# Altium schematic sheet WLAN_BLUETOOTH.SchDoc: WLAN_BLUETOOTH
size A4; Project: STM32MP15-DISCO PI; Date: Not used; ApprovedBy: Not used; CheckedBy: Not used; Author: Not used; CompanyName: STMicroelectronics; DrawnBy: Not used; Engineer: Not used; Organization: Not used; Address1: Not used; Address2: Not used; Address3: Not used; Address4: Not used; DocumentNumber: 14; Revision: Not used; SheetNumber: 14; SheetTotal: 15; CurrentTime: Not used; CurrentDate: Not used; Time: Not used; DocumentFullPathAndName: Not used; DocumentName: Not used; ModifiedDate: Not used; ImagePath: Not used; ProjectName: Not used; Application_BuildNumber: Not used
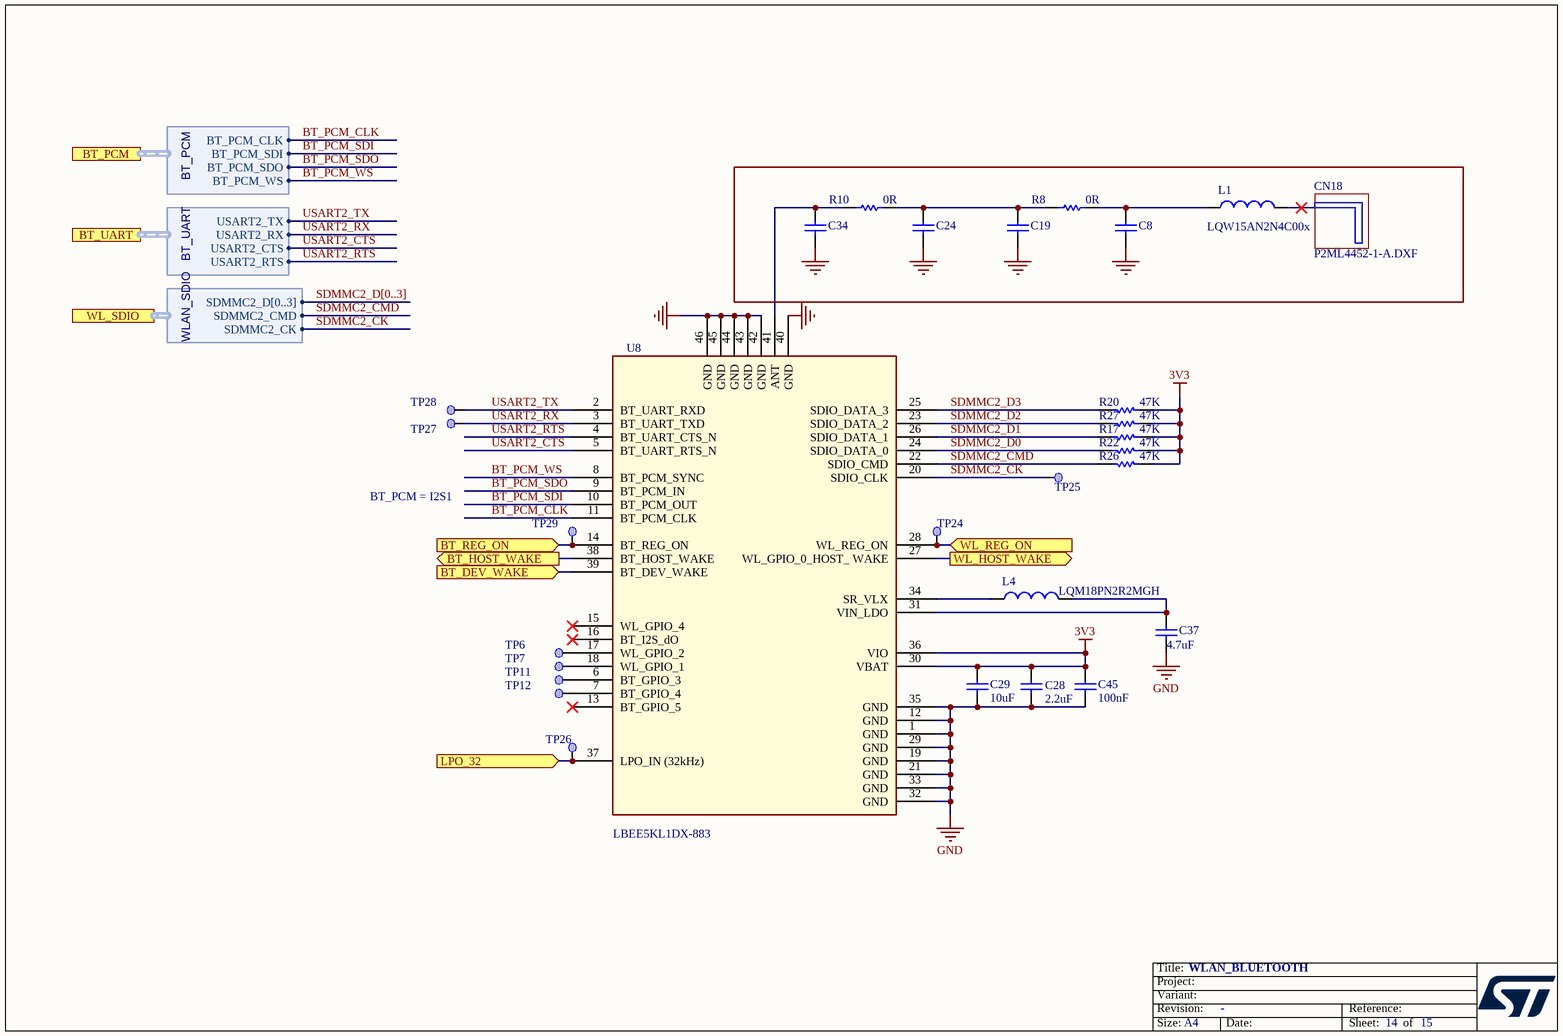
[diagram p0: WLAN_BLUETOOTH.SchDoc]

## Parts
C8  Capacitor  [C0402]  (value not drawn)
C19  Capacitor  [C0402]  (value not drawn)
C24  Capacitor  [C0402]  (value not drawn)
C28  value 2.2uF  [C0603]  (hidden comment: Capacitor)
C29  value 10uF  [C0603]  (hidden comment: Capacitor)
C34  Capacitor  [C0402]  (value not drawn)
C37  value 4.7uF  [C0402]  (hidden comment: Capacitor)
C45  value 100nF  [C0402]
CN18  value P2ML4452-1-A.DXF  [ANT_MURATA_TYPE-1-DX_P2ML4452-1-A_DXF]  (hidden comment: antenna_Wifi_BLE_Murata)  (no BOM)
L1  value LQW15AN2N4C00x  [IND_0402_MURATA_LQW15AN2N4C00X]  (hidden comment: Inductor)
L4  value LQM18PN2R2MGH  [L0603]  (hidden comment: Inductor)
R8  value 0R  [R0402]  (hidden comment: Resistor)
R10  value 0R  [R0402]  (hidden comment: Resistor)
R17  value 47K  [R0402]  (hidden comment: Resistor)
R20  value 47K  [R0402]  (hidden comment: Resistor)
R22  value 47K  [R0402]  (hidden comment: Resistor)
R26  value 47K  [R0402]  (hidden comment: Resistor)
R27  value 47K  [R0402]  (hidden comment: Resistor)
TP6  Test Point  [TP_SMD_1MM]  (value not drawn)  (no BOM)
TP7  Test Point  [TP_SMD_1MM]  (value not drawn)  (no BOM)
TP11  Test Point  [TP_SMD_1MM]  (value not drawn)  (no BOM)
TP12  Test Point  [TP_SMD_1MM]  (value not drawn)  (no BOM)
TP24  Test Point  [TP_SMD_0-6MM]  (value not drawn)  (no BOM)
TP25  Test Point  [TP_SMD_0-6MM]  (value not drawn)  (no BOM)
TP26  Test Point  [TP_SMD_0-6MM]  (value not drawn)  (no BOM)
TP27  Test Point  [TP_SMD_0-6MM]  (value not drawn)  (no BOM)
TP28  Test Point  [TP_SMD_0-6MM]  (value not drawn)  (no BOM)
TP29  Test Point  [TP_SMD_0-6MM]  (value not drawn)  (no BOM)
U8  LBEE5KL1DX-883  [MOD_WLAN-BT_MURATA_LBEE5KL1DX-883]

## Ports
BT_DEV_WAKE (in), BT_HOST_WAKE (out), BT_PCM (harness BT_PCM), BT_REG_ON (in), BT_UART (harness BT_UART), LPO_32 (in), WL_HOST_WAKE (out), WL_REG_ON (in), WL_SDIO (harness WLAN_SDIO)

## Harnesses
BT_PCM: BT_PCM_CLK, BT_PCM_SDI, BT_PCM_SDO, BT_PCM_WS
BT_UART: USART2_TX, USART2_RX, USART2_CTS, USART2_RTS
WLAN_SDIO: SDMMC2_D[0..3], SDMMC2_CMD, SDMMC2_CK

## Nets
3V3: C28.2 C29.2 C45.2 R17.1 R20.1 R22.1 R26.1 R27.1 U8.30(VBAT) U8.36(VIO)
GND: C8.1 C19.1 C24.1 C28.1 C29.1 C34.1 C37.1 C45.1 U8.1(GND) U8.12(GND) U8.19(GND) U8.21(GND) U8.29(GND) U8.32(GND) U8.33(GND) U8.35(GND) U8.40(GND) U8.42(GND) U8.43(GND) U8.44(GND) U8.45(GND) U8.46(GND)
BT_DEV_WAKE: U8.39(BT_DEV_WAKE) ; port BT_DEV_WAKE
BT_HOST_WAKE: U8.38(BT_HOST_WAKE) ; port BT_HOST_WAKE
BT_PCM_CLK: U8.11(BT_PCM_CLK) ; port BT_PCM.BT_PCM_CLK
BT_PCM_SDI: U8.10(BT_PCM_OUT) ; port BT_PCM.BT_PCM_SDI
BT_PCM_SDO: U8.9(BT_PCM_IN) ; port BT_PCM.BT_PCM_SDO
BT_PCM_WS: U8.8(BT_PCM_SYNC) ; port BT_PCM.BT_PCM_WS
BT_REG_ON: TP29.1 U8.14(BT_REG_ON) ; port BT_REG_ON
LPO_32: TP26.1 U8.37(LPO_IN_(32kHz)) ; port LPO_32
SDMMC2_CK: TP25.1 U8.20(SDIO_CLK) ; port WL_SDIO.SDMMC2_CK
SDMMC2_CMD: R26.2 U8.22(SDIO_CMD) ; port WL_SDIO.SDMMC2_CMD
SDMMC2_D0: R22.2 U8.24(SDIO_DATA_0)
SDMMC2_D1: R17.2 U8.26(SDIO_DATA_1)
SDMMC2_D2: R27.2 U8.23(SDIO_DATA_2)
SDMMC2_D3: R20.2 U8.25(SDIO_DATA_3)
USART2_CTS: U8.5(BT_UART_RTS_N) ; port BT_UART.USART2_CTS
USART2_RTS: U8.4(BT_UART_CTS_N) ; port BT_UART.USART2_RTS
USART2_RX: TP27.1 U8.3(BT_UART_TXD) ; port BT_UART.USART2_RX
USART2_TX: TP28.1 U8.2(BT_UART_RXD) ; port BT_UART.USART2_TX
WL_HOST_WAKE: U8.27(WL_GPIO_0_HOST__WAKE) ; port WL_HOST_WAKE
WL_REG_ON: TP24.1 U8.28(WL_REG_ON) ; port WL_REG_ON
NetC8_2: C8.2 L1.1 R8.1
NetC19_2: C19.2 C24.2 R8.2 R10.1
NetC34_2: C34.2 R10.2 U8.41(ANT)
NetC37_2: C37.2 L4.2 U8.31(VIN_LDO)
NetL4_1: L4.1 U8.34(SR_VLX)
NetTP6_1: TP6.1 U8.17(WL_GPIO_2)
NetTP7_1: TP7.1 U8.18(WL_GPIO_1)
NetTP11_1: TP11.1 U8.6(BT_GPIO_3)
NetTP12_1: TP12.1 U8.7(BT_GPIO_4)

Not connected (* = marked no-connect by the designer): L1 2*; U8 13(BT_GPIO_5)* 15(WL_GPIO_4)* 16(BT_I2S_dO)*

## Buses and harness runs
bus SDMMC2_D[0..3]

## Notes on the sheet
- BT_PCM = I2S1
- Title:
- Project:
- Size:
- Revision:
- Variant:
- A4
- -
- Date:
- Reference:
- Sheet:
- of

## Library data of the parts
C8 C19 C24 C34 = MCD-00200: Capacitor, MLCC, 12pF, 50V, NPO, 5%, 0402, T=0,5mm; Manufacturer_Part_Number: CC0402JRNPO9BN120; Manufacturer: YAGEO; Provided_By: SUBCO; Internal_Part_Number: MCD-00200; Value: 12pF; Status: Footprint available; Part_Type: Capacitor; Package: C0402; ComponentLink1Description: Datasheet; ComponentLink1URL: http://tunmcdsvn.tun.st.com/Component_Datasheet_Library/Trunk/Capacitors/Yageo_Capacitor_NP0_16V-to-50V
C28 = MCD-00012: Capacitor, MLCC, 2.2uF, 10V, X5R, 10%, 0603, T=0,8mm; Manufacturer_Part_Number: CC0603KRX5R6BB225; Manufacturer: YAGEO; Alternate_Manufacturer_Part_Number: C0603C225K8PACTU; Alternate_Manufacturer: KEMET; Provided_By: SUBCO; Initial_Board_Reference: MB1274; Internal_Part_Number: MCD-00012; ComponentLink1Description: Datasheet; ECCN_US: n/a; ECCN_EU: n/a; Status: Released; Part_Type: Capacitor; Package: C0603; ComponentLink1URL: http://tunmcdsvn.tun.st.com/Component_Datasheet_Library/Trunk/Capacitors/Yageo_Multilayer_capacitor_X5R_series_100pF_to_100uF
C29 = MCD-00099: Capacitor, MLCC, 10uF, 10V, X5R, 10%, 0603, T=0,8mm; Manufacturer_Part_Number: GRM188R61A106KE69D; Manufacturer: MURATA; ECCN_US: EAR99; ECCN_EU: NEC; Provided_By: SUBCO; Initial_Board_Reference: MB1262; Internal_Part_Number: MCD-00099; Status: Released; Part_Type: Capacitor; Package: C0603; ComponentLink1Description: Datasheet; ComponentLink1URL: http://tunmcdsvn.tun.st.com/Component_Datasheet_Library/Trunk/Capacitors/Murata_Capacitor_GR_series
C37 = MCD-01356: Capacitor, MLCC, 4.7uF, 6V3, X5R, 20%, 0402, T=0,5mm; Manufacturer_Part_Number: GRM155R60J475ME47; Manufacturer: MURATA; Provided_By: SUBCO; Internal_Part_Number: MCD-01356; ComponentLink1Description: Datasheet; Status: Released; Part_Type: Capacitor; Package: C0402; ComponentLink1URL: http://tunmcdsvn.tun.st.com/Component_Datasheet_Library/Trunk/Capacitors/Murata_Capacitor_GR_series
C45 = MCD-00006: Capacitor,100nF,16V,X7R,10%,0402; Manufacturer_Part_Number: CC0402KRX7R7BB104; Manufacturer: YAGEO; Alternate_Manufacturer: MURATA; Alternate_Manufacturer_Part_Number: GCM155R71C104KA55D; Provided_By: SUBCO; Initial_Board_Reference: MB1274; Internal_Part_Number: MCD-00006; ComponentLink1Description: Datasheet; ECCN_US: n/a; ECCN_EU: n/a; Status: Released; Part_Type: Capacitor; Package: C0402; ComponentLink1URL: http://tunmcdsvn.tun.st.com/Component_Datasheet_Library/Trunk/Capacitors/Yageo_Multilayer_Capacitor_X7R_series_100pF_to_22uF
CN18 = MCD-00656: Murata_Type1DX_AntennaDesign_P2ML4452-1-A.DXF; Part_Type: Misc; Manufacturer: MURATA; Initial_Board_Reference: MB1272; Internal_Part_Number: MCD-00656; Status: Footprint available; Manufacturer_Part_Number: Antenna design; ComponentLink1Description: Datasheet; ComponentLink1URL: http://tunmcdsvn.tun.st.com/Component_Datasheet_Library/Trunk/Misc/Murata_Type1DX_AntennaDesign_20160311; ECCN_US: n/a; ECCN_EU: n/a; Provided_By: n/a
L1 = MCD-00657: Inductor,2.4nH,+-0.2nH,0.05R,0.85A,0402; Manufacturer: MURATA; Provided_By: SUBCO; Initial_Board_Reference: MB1272; Internal_Part_Number: MCD-00657; Status: Footprint available; Part_Type: Inductor; Manufacturer_Part_Number: LQW15AN2N4C00x; Package: L0402; ComponentLink1Description: Datasheet; ComponentLink1URL: http://tunmcdsvn.tun.st.com/Component_Datasheet_Library/Trunk/Inductors/Murata_inductor_LQW15AN2N4C00x_; ECCN_US: n/a; ECCN_EU: n/a
L4 = MCD-00659: Inductor, 2.2µH, 20%, Isat 0.35A, DCR 0.2Ohm, 0603; Manufacturer: MURATA; Provided_By: SUBCO; Initial_Board_Reference: MB1272; Internal_Part_Number: MCD-00659; Status: Footprint available; Part_Type: Inductor; Manufacturer_Part_Number: LQM18PN2R2MGH; Package: L0603; ComponentLink1Description: Datasheet; ComponentLink1URL: http://tunmcdsvn.tun.st.com/Component_Datasheet_Library/Trunk/Inductors/Murata_inductor_LQM18PN2R2MGHx; ECCN_US: n/a; ECCN_EU: n/a
R8 R10 = MCD-00052: Resistor,0R,0402,5%,1/16W; Manufacturer_Part_Number: RC0402JR-070RL; Manufacturer: YAGEO; Provided_By: SUBCO; Initial_Board_Reference: MB1274; Internal_Part_Number: MCD-00052; Status: Released; Part_Type: Resistor; Package: R0402; ComponentLink1Description: Datasheet; ComponentLink1URL: http://tunmcdsvn.tun.st.com/Component_Datasheet_Library/Trunk/Resistors/Yageo_Resistor_RC0402-series; ECCN_US: n/a; ECCN_EU: n/a
R17 R20 R22 R26 R27 = MCD-00063: Resistor,47K,0402,1%,1/16W; Manufacturer_Part_Number: RC0402FR-0747KL; Manufacturer: YAGEO; Provided_By: SUBCO; Initial_Board_Reference: MB1274; Internal_Part_Number: MCD-00063; ComponentLink1Description: Datasheet; ECCN_US: n/a; ECCN_EU: n/a; Status: Released; Part_Type: Resistor; ComponentLink1URL: http://tunmcdsvn.tun.st.com/Component_Datasheet_Library/Trunk/Resistors/Yageo_Resistor_RC0402-series; Package: R0402
TP6 TP7 TP11 TP12 = MCD-00074: Test Point 1mm; Part_Type: Mechanical; Initial_Board_Reference: MB1274; Internal_Part_Number: MCD-00074; ECCN_US: n/a; ECCN_EU: n/a; Provided_By: n/a; Status: Released; Manufacturer_Part_Number: n/a; Manufacturer: n/a; ComponentLink1Description: Datasheet; ComponentLink1URL: http://na
TP24-TP29 = MCD-00631: Test Point 0.6mm; Part_Type: Mechanical; Initial_Board_Reference: MB1264; Internal_Part_Number: MCD-00631; Status: Released; ECCN_US: n/a; ECCN_EU: n/a; Provided_By: n/a; ComponentLink1Description: Datasheet
U8 = MCD-00268: IEEE802.11b/g/n W-LAN + Bluetooth 4.1+EDR module; Manufacturer: MURATA; Part_Type: IC; Provided_By: SUBCO; ECCN_US: 5A992C; Initial_Board_Reference: MB1272; Value: LBEE5KL1DX-883; Internal_Part_Number: MCD-00268; Manufacturer_Part_Number: LBEE5KL1DX-883; ComponentLink1Description: Datasheet; ComponentLink1URL: http://tunmcdsvn.tun.st.com/Component_Datasheet_Library/Trunk/IC/MURATA_LBEE5KL1DX_wifi_BLE; Status: Checked